# EAGLE design Daughter board (EAGLE 9.5.2)
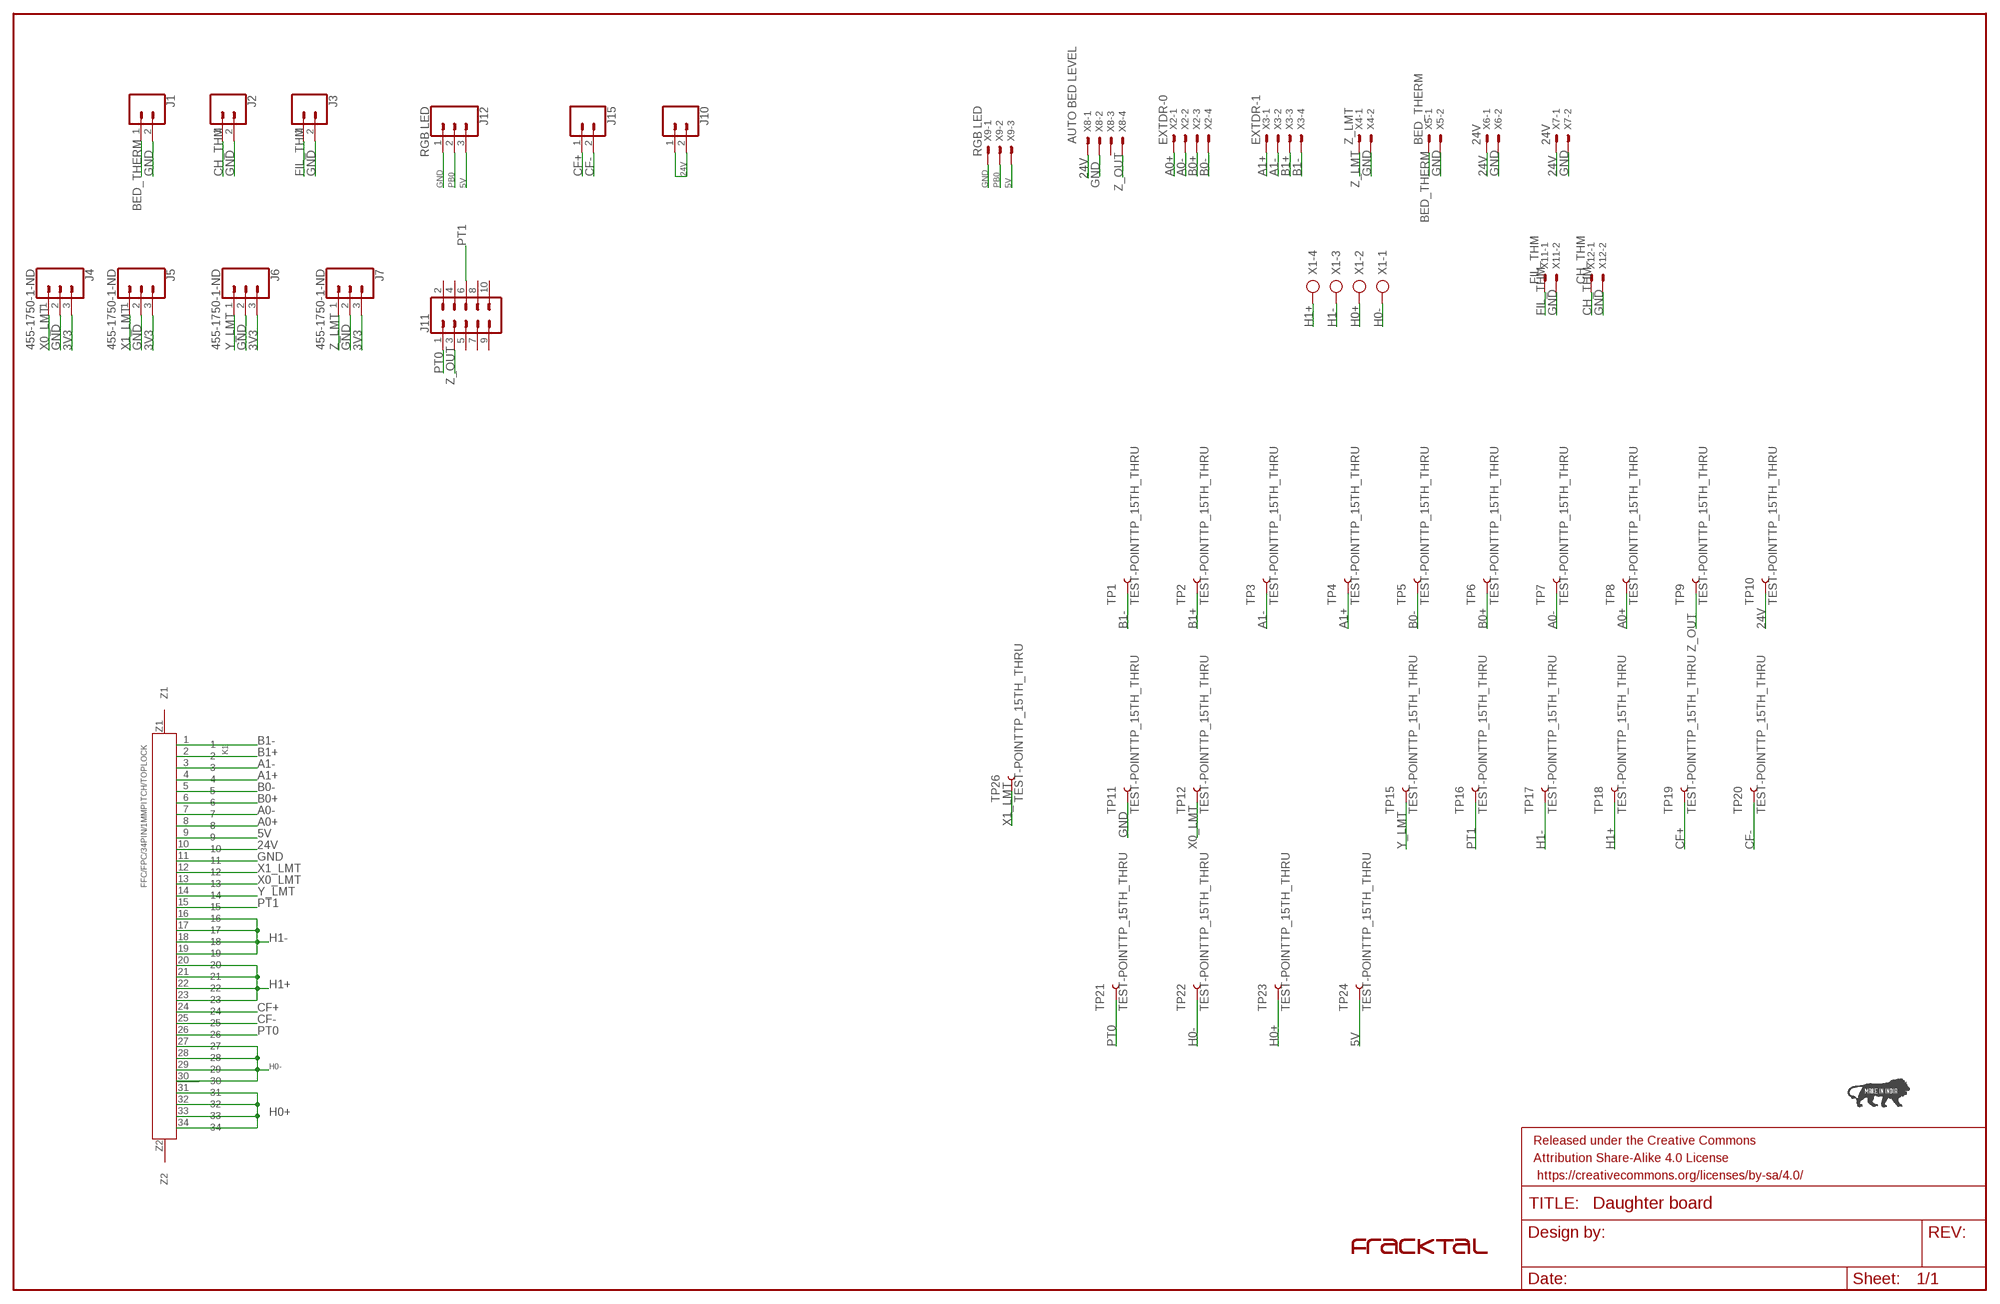
[diagram p0: schematic, sheet 1]

## Parts
FRAME1  FRAME-LEDGER  [CREATIVE_COMMONS]
J1  CONN_02  [1X02]
J2  CONN_02  [1X02]
J3  CONN_02  [1X02]
J4  455-1750-1-ND  CONN_03  [1X03]
J5  455-1750-1-ND  CONN_03  [1X03]
J6  455-1750-1-ND  CONN_03  [1X03]
J7  455-1750-1-ND  CONN_03  [1X03]
J10  CONN_02  [1X02]
J11  CONN_05X2NO_SILK  [2X5_NOSILK]
J12  RGB LED  CONN_03  [1X03]
J15  CONN_02  [1X02]
K1  FFC/FPC/34PIN/1MMPITCH/TOPLOCK  [34PIN/1MMPITCH/FFC/FPC]
TP1  TEST-POINTTP_15TH_THRU  [TP_15TH]
TP2  TEST-POINTTP_15TH_THRU  [TP_15TH]
TP3  TEST-POINTTP_15TH_THRU  [TP_15TH]
TP4  TEST-POINTTP_15TH_THRU  [TP_15TH]
TP5  TEST-POINTTP_15TH_THRU  [TP_15TH]
TP6  TEST-POINTTP_15TH_THRU  [TP_15TH]
TP7  TEST-POINTTP_15TH_THRU  [TP_15TH]
TP8  TEST-POINTTP_15TH_THRU  [TP_15TH]
TP9  TEST-POINTTP_15TH_THRU  [TP_15TH]
TP10  TEST-POINTTP_15TH_THRU  [TP_15TH]
TP11  TEST-POINTTP_15TH_THRU  [TP_15TH]
TP12  TEST-POINTTP_15TH_THRU  [TP_15TH]
TP15  TEST-POINTTP_15TH_THRU  [TP_15TH]
TP16  TEST-POINTTP_15TH_THRU  [TP_15TH]
TP17  TEST-POINTTP_15TH_THRU  [TP_15TH]
TP18  TEST-POINTTP_15TH_THRU  [TP_15TH]
TP19  TEST-POINTTP_15TH_THRU  [TP_15TH]
TP20  TEST-POINTTP_15TH_THRU  [TP_15TH]
TP21  TEST-POINTTP_15TH_THRU  [TP_15TH]
TP22  TEST-POINTTP_15TH_THRU  [TP_15TH]
TP23  TEST-POINTTP_15TH_THRU  [TP_15TH]
TP24  TEST-POINTTP_15TH_THRU  [TP_15TH]
TP26  TEST-POINTTP_15TH_THRU  [TP_15TH]
U$1  FRACKTALLOGO  [FRACKTALLOGO]
U$2  MAKEININDIA  [MAKEININDIA]
X1  AK500/4  [AK500/4]
X2  EXTDR-0  JST-XH-04-PIN-LONG-PAD  [JST-XH-04-PACKAGE-LONG-PAD]
X3  EXTDR-1  JST-XH-04-PIN-LONG-PAD  [JST-XH-04-PACKAGE-LONG-PAD]
X4  Z_LMT  JST-XH-02-PIN-LONG-PAD  [JST-XH-02-PACKAGE-LONG-PAD]
X5  BED_THERM  JST-XH-02-PIN-LONG-PAD  [JST-XH-02-PACKAGE-LONG-PAD]
X6  24V  JST-XH-02-PIN-LONG-PAD  [JST-XH-02-PACKAGE-LONG-PAD]
X7  24V  JST-XH-02-PIN-LONG-PAD  [JST-XH-02-PACKAGE-LONG-PAD]
X8  AUTO BED LEVELING  JST-XH-04-PIN-LONG-PAD  [JST-XH-04-PACKAGE-LONG-PAD]
X9  RGB LED  JST-XH-03-PIN-LONG-PAD  [JST-XH-03-PACKAGE-LONG-PAD]
X11  FIL_THM  JST-XH-02-PIN-LONG-PAD  [JST-XH-02-PACKAGE-LONG-PAD]
X12  CH_THM  JST-XH-02-PIN-LONG-PAD  [JST-XH-02-PACKAGE-LONG-PAD]

## Nets
3V3: J4.3 J5.3 J6.3 J7.3
5V: J12.3 K1.9 TP24.P$1 X9.3
24V: J10.1 J10.2 K1.10 TP10.P$1 X6.1 X7.1 X8.1
A0+: K1.8 TP8.P$1 X2.1
A0-: K1.7 TP7.P$1 X2.2
A1+: K1.4 TP4.P$1 X3.1
A1-: K1.3 TP3.P$1 X3.2
B0+: K1.6 TP6.P$1 X2.3
B0-: K1.5 TP5.P$1 X2.4
B1+: K1.2 TP2.P$1 X3.3
B1-: K1.1 TP1.P$1 X3.4
BED_THERM: J1.1 X5.1
CF+: J15.1 K1.24 TP19.P$1
CF-: J15.2 K1.25 TP20.P$1
CH_THM: J2.1 X12.1
FIL_THM: J3.1 X11.1
GND: J1.2 J2.2 J3.2 J4.2 J5.2 J6.2 J7.2 J12.1 K1.11 TP11.P$1 X4.2 X5.2 X6.2 X7.2 X8.2 X9.1 X11.2 X12.2
H0+: K1.31 K1.32 K1.33 K1.34 TP23.P$1 X1.2
H0-: K1.27 K1.28 K1.29 K1.30 TP22.P$1 X1.1
H1+: K1.20 K1.21 K1.22 K1.23 TP18.P$1 X1.4
H1-: K1.16 K1.17 K1.18 K1.19 TP17.P$1 X1.3
PB0: J12.2 X9.2
PT0: J11.1 K1.26 TP21.P$1
PT1: J11.6 K1.15 TP16.P$1
X0_LMT: J4.1 K1.13 TP12.P$1
X1_LMT: J5.1 K1.12 TP26.P$1
Y_LMT: J6.1 K1.14 TP15.P$1
Z_LMT: J7.1 X4.1
Z_OUT: J11.3 TP9.P$1 X8.4
Unconnected: J11.2 J11.4 J11.5 J11.7 J11.8 J11.9 J11.10 K1.Z1 K1.Z2 X8.3

## Library data of the parts
FRAME1 = SparkFun-Aesthetics:FRAME-LEDGER: Schematic Frame - Ledger Standard 11x14 US Ledger frame
J1-J3 J10 J15 = SparkFun-Connectors:CONN_02: Multi connection point. Often used as Generic Header-pin footprint for 0.1 inch spaced/style header connections On any of the 0.1 inch spaced packages, you can populate with these: Break Away Headers - Straight <https://www.sparkfun.com/products/116> (PRT-00116) Break Away Male Headers - Right Angle <https://www.sparkfun.com/products/553> (PRT-00553) Female Headers <https://www.sparkfun.com/products/115> (PRT-00115) Break Away Headers - Machine Pin <https://www.sparkfun.com/products/117> (PRT-00117) Break Away Female Headers - Swiss Machine Pin <https://www.sparkfun.com/products/743> (PRT-00743) For SCREWTERMINALS and SPRING TERMINALS visit here: Screw Terimnals on SparkFun.com <https://www.sparkfun.com/search/results?term=Screw+Terminals> (5mm/3.5mm/2.54mm spacing) This device is also useful as a general connection point to wire up your design to another part of your project. Our various solder wires solder well into these plated through hole pads. Hook-Up Wire - Assortment (Stranded, 22 AWG) <https://www.sparkfun.com/products/11375> (PRT-11375) Hook-Up Wire - Assortment (Solid Core, 22 AWG) <https://www.sparkfun.com/products/11367> (PRT-11367) View the entire wire category on our website here <https://www.sparkfun.com/categories/141> Special notes: Molex polarized connector foot print use with: PRT-08233 with associated crimp pins and housings. 2.54_SCREWTERM for use with PRT-10571. 3.5mm Screw Terminal footprints for PRT-08084 5mm Screw Terminal footprints for use with PRT-08432
J4-J7 = SparkFun-Connectors:CONN_03: Multi connection point. Often used as Generic Header-pin footprint for 0.1 inch spaced/style header connections On any of the 0.1 inch spaced packages, you can populate with these: Break Away Headers - Straight <https://www.sparkfun.com/products/116> (PRT-00116) Break Away Male Headers - Right Angle <https://www.sparkfun.com/products/553> (PRT-00553) Female Headers <https://www.sparkfun.com/products/115> (PRT-00115) Break Away Headers - Machine Pin <https://www.sparkfun.com/products/117> (PRT-00117) Break Away Female Headers - Swiss Machine Pin <https://www.sparkfun.com/products/743> (PRT-00743) Stackable Header - 3 Pin (Female, 0.1") <https://www.sparkfun.com/products/13875> (PRT-13875) For SCREWTERMINALS and SPRING TERMINALS visit here: Screw Terimnals on SparkFun.com <https://www.sparkfun.com/search/results?term=Screw+Terminals> (5mm/3.5mm/2.54mm spacing) This device is also useful as a general connection point to wire up your design to another part of your project. Our various solder wires solder well into these plated through hole pads. Hook-Up Wire - Assortment (Stranded, 22 AWG) <https://www.sparkfun.com/products/11375> (PRT-11375) Hook-Up Wire - Assortment (Solid Core, 22 AWG) <https://www.sparkfun.com/products/11367> (PRT-11367) View the entire wire category on our website here <https://www.sparkfun.com/categories/141> Special notes: Molex polarized connector foot print use with SKU : PRT-08232 with associated crimp pins and housings.; PROD_ID: XXX-00000
J11 = SparkFun-Connectors:CONN_05X2: Multi connection point. Often used as Generic Header-pin footprint for 0.1 inch spaced/style header connections For AVR SPI programming port, see special device with nice symbol: "AVR_SPI_PROG_5x2.dev" You can populate with any combo of single row headers, but if you'd like an exact match, check these: 2x5 AVR ICSP Male Header <https://www.sparkfun.com/products/778> (PRT-00778) 2x5 Pin Shrouded Header <https://www.sparkfun.com/products/8506> (PRT-08506) On any of the 0.1 inch spaced packages, you can populate with these: Break Away Headers - Straight <https://www.sparkfun.com/products/116> (PRT-00116) Break Away Male Headers - Right Angle <https://www.sparkfun.com/products/553> (PRT-00553) Female Headers <https://www.sparkfun.com/products/115> (PRT-00115) Break Away Headers - Machine Pin <https://www.sparkfun.com/products/117> (PRT-00117) Break Away Female Headers - Swiss Machine Pin <https://www.sparkfun.com/products/743> (PRT-00743) Special note: the shrouded connector mates well with our 5x2 ribbon cables: 2x5 Pin IDC Ribbon Cable <https://www.sparkfun.com/products/8535> (PRT-08535)
J12 = SparkFun-Connectors:CONN_03: Multi connection point. Often used as Generic Header-pin footprint for 0.1 inch spaced/style header connections On any of the 0.1 inch spaced packages, you can populate with these: Break Away Headers - Straight <https://www.sparkfun.com/products/116> (PRT-00116) Break Away Male Headers - Right Angle <https://www.sparkfun.com/products/553> (PRT-00553) Female Headers <https://www.sparkfun.com/products/115> (PRT-00115) Break Away Headers - Machine Pin <https://www.sparkfun.com/products/117> (PRT-00117) Break Away Female Headers - Swiss Machine Pin <https://www.sparkfun.com/products/743> (PRT-00743) Stackable Header - 3 Pin (Female, 0.1") <https://www.sparkfun.com/products/13875> (PRT-13875) For SCREWTERMINALS and SPRING TERMINALS visit here: Screw Terimnals on SparkFun.com <https://www.sparkfun.com/search/results?term=Screw+Terminals> (5mm/3.5mm/2.54mm spacing) This device is also useful as a general connection point to wire up your design to another part of your project. Our various solder wires solder well into these plated through hole pads. Hook-Up Wire - Assortment (Stranded, 22 AWG) <https://www.sparkfun.com/products/11375> (PRT-11375) Hook-Up Wire - Assortment (Solid Core, 22 AWG) <https://www.sparkfun.com/products/11367> (PRT-11367) View the entire wire category on our website here <https://www.sparkfun.com/categories/141> Special notes: Molex polarized connector foot print use with SKU : PRT-08232 with associated crimp pins and housings.; PROD_ID: XXX-00000; VALUE: 455-1750-1-ND
K1 = FracktalWorks_Eagle_Library:FFC/FPC/34PIN/1MMPITCH/TOPLOCK
TP1-TP12 TP15-TP24 TP26 = SparkFun-Connectors:TEST-POINT: SparkFun Test Points Bare copper test points for troubleshooting or In-Circuit-Testing. These are used by our Production team for verifying production board runs using pogo-pins on test beds. SparkFun Products: SparkFun LSM9DS1 Breakout <https://www.sparkfun.com/products/13284> SparkFun PSOC <https://www.sparkfun.com/products/13714> SparkFun Load Cell Amplifier <https://www.sparkfun.com/products/13879>
U$1 = FracktalWorks_Eagle_Library:FRACKTALLOGO
U$2 = FracktalWorks_Eagle_Library:MAKEININDIA
X1 = con-ptr500:AK500/4: CONNECTOR; OC_FARNELL: unknown; OC_NEWARK: unknown
X2 X3 = Rembrandt Electronics - JST XH Connectors v1-0:JST-XH-04-PIN: JST XH Connector 2 Pin Wire to board connector. Pitch: 2,54 mm, (0.100") Number of pins: 4 Created by Rembrandt Electronics www.rembrandtelectronics.com
X4-X7 X11 X12 = Rembrandt Electronics - JST XH Connectors v1-0:JST-XH-02-PIN: JST XH Connector 2 Pin Wire to board connector. Pitch: 2,54 mm, (0.100") Number of pins: 2 Created by Rembrandt Electronics www.rembrandtelectronics.com
X8 = Rembrandt Electronics - JST XH Connectors v1-0:JST-XH-04-PIN: JST XH Connector 2 Pin Wire to board connector. Pitch: 2,54 mm, (0.100") Number of pins: 4 Created by Rembrandt Electronics www.rembrandtelectronics.com; AUTOBEDLEVL: AUTO BED LEVEL
X9 = Rembrandt Electronics - JST XH Connectors v1-0:JST-XH-03-PIN: JST XH Connector 2 Pin Wire to board connector. Pitch: 2,54 mm, (0.100") Number of pins: 3 Created by Rembrandt Electronics www.rembrandtelectronics.com

## Net classes
0 default: width 0.406 mm, drill 0.254 mm, clearance 0.203 mm

## Board
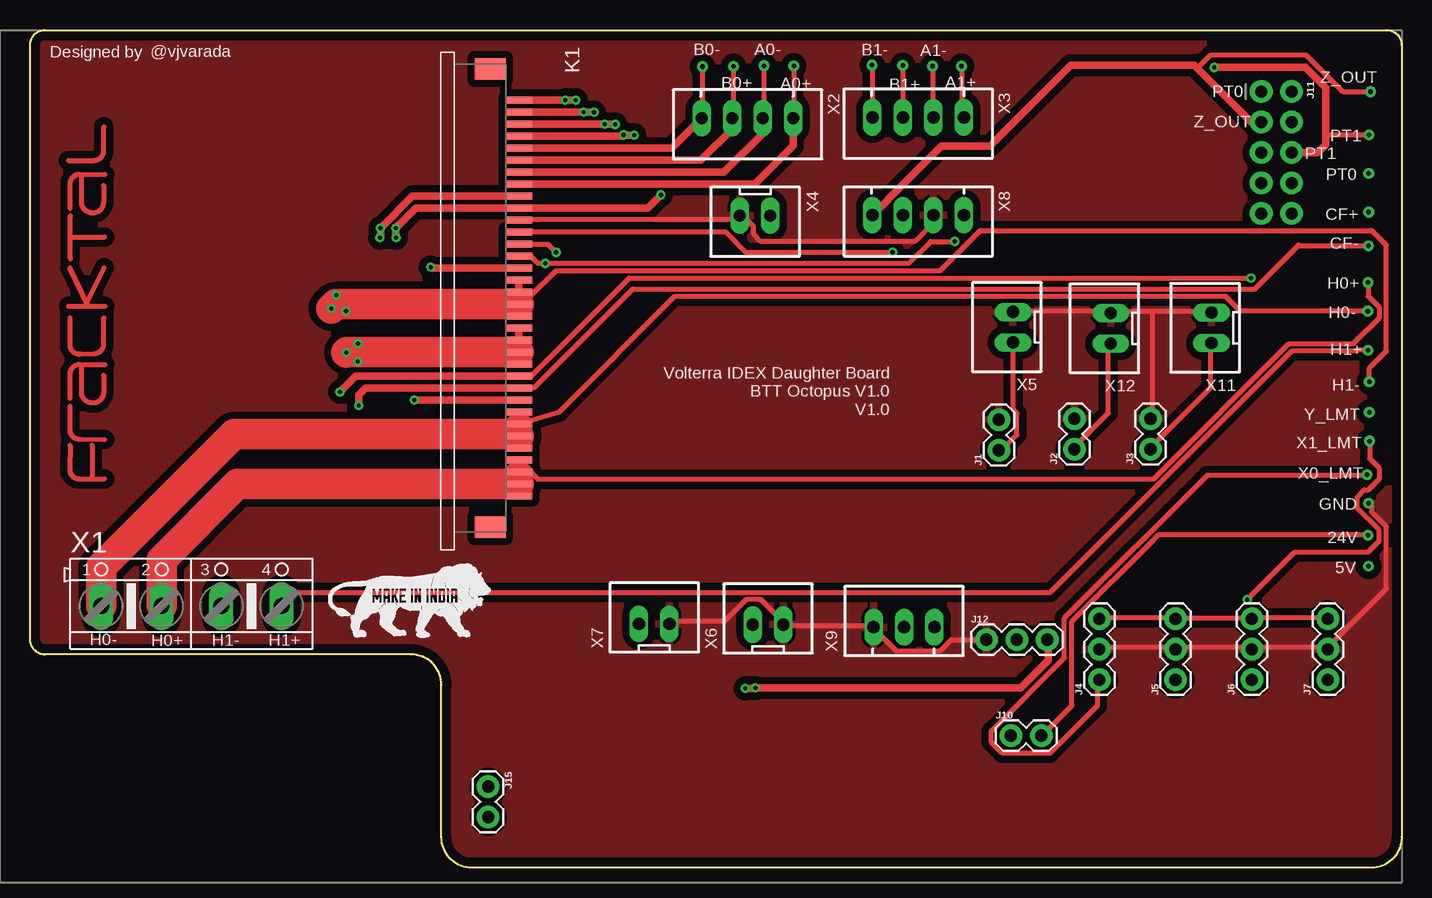
[diagram p1: board, top side]
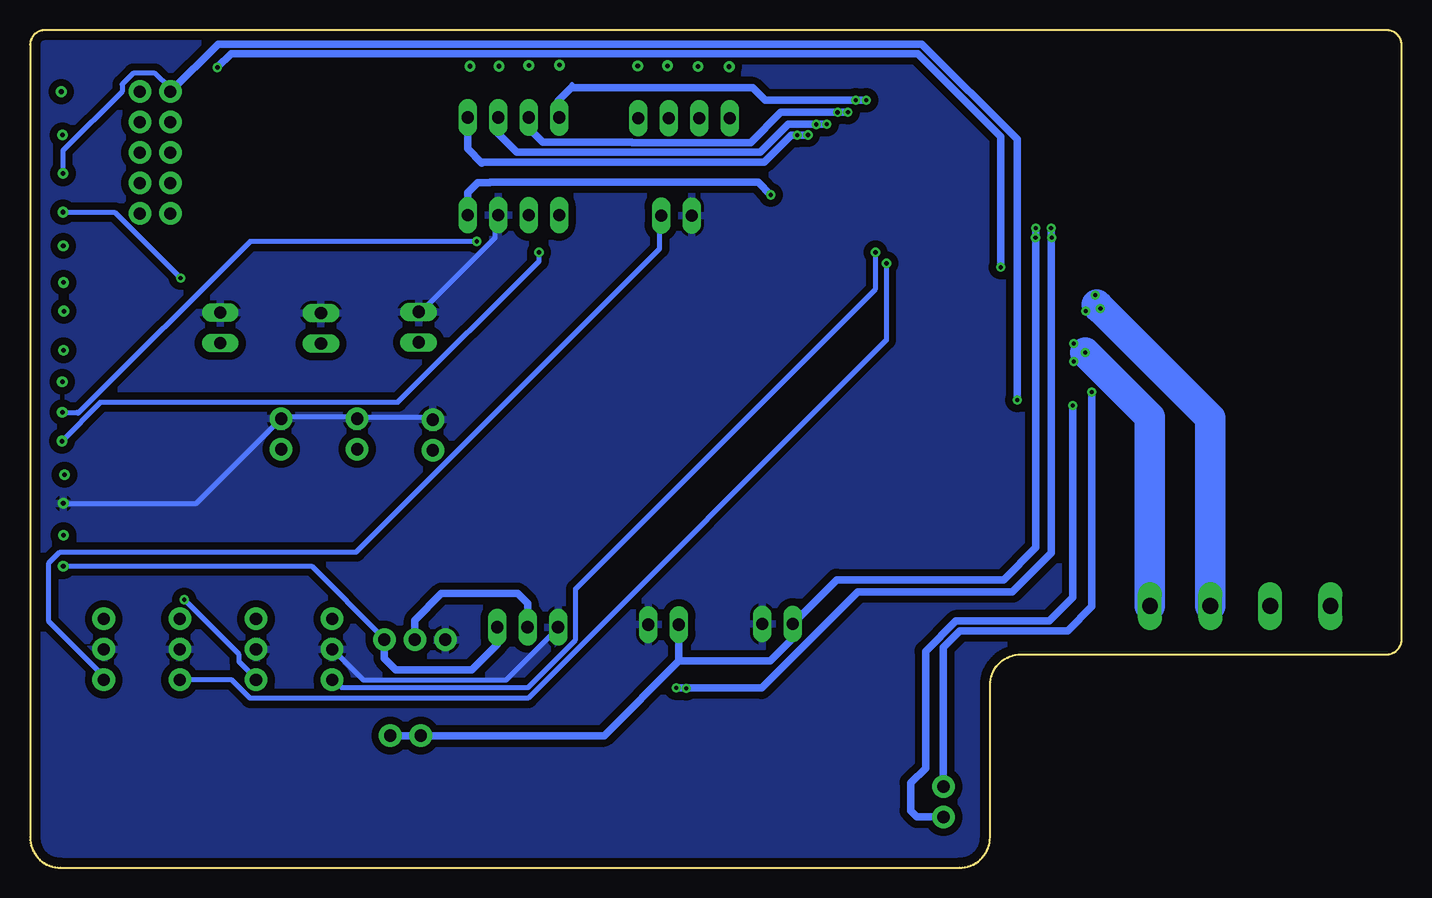
[diagram p2: board, bottom side, seen from below]

Size 114.3 x 69.85 mm. Coordinates in mm from the lower left corner, seen from the top.
Outline: 1.27,69.85 113.03,69.85 arc-90 114.3,68.58 114.3,2.54 arc-90 111.76,0 36.83,0 arc-90 34.29,2.54 34.29,15.24 arc90 31.75,17.78 1.27,17.78 arc-90 0,19.05 0,68.58 arc-90 1.27,69.85
Copper layers (1*16): Top 0.035mm / dielectric 1.5mm / Bottom 0.035mm
Design rules "LionCircuits": minimum track width 8mil, minimum drill 0.35mm, track to track 8mil, track to pad 8mil, pad to pad 8mil, via to via 8mil, smd to smd 8mil, copper to edge 30mil, drill to drill 10mil, minimum pad ring 10mil, minimum via ring 8mil, stop-mask expansion 4mil, vias tented up to drill 0mil, thermal gap 10mil

### Footprints (pad centres in the part's own frame; a part is rotated, then mirrored left to right if it is on the bottom)
1X02 = drill 1.016 pad 1.88: 1 0,0; 2 2.54,0
1X03 = drill 1.016 pad 1.88: 1 0,0; 2 2.54,0; 3 5.08,0
2X5_NOSILK = drill 1.016 pad 1.88: 1 0,0; 2 0,2.54; 3 2.54,0; 4 2.54,2.54; 5 5.08,0; 6 5.08,2.54; 7 7.62,0; 8 7.62,2.54; 9 10.16,0; 10 10.16,2.54
34PIN/1MMPITCH/FFC/FPC = smd 0.6 x 2.2: 1 -14.43,2.1; 2 -13.43,2.1; 3 -12.43,2.1; 4 -11.43,2.1; 5 -10.43,2.1; 6 -9.43,2.1; 7 -8.43,2.1; 8 -7.43,2.1; 9 -6.43,2.1; 10 -5.43,2.1; 11 -4.43,2.1; 12 -3.43,2.1; 13 -2.43,2.1; 14 -1.43,2.1; 15 -0.43,2.1; 16 0.57,2.1; 17 1.57,2.1; 18 2.57,2.1; 19 3.57,2.1; 20 4.57,2.1; 21 5.57,2.1; 22 6.57,2.1; 23 7.57,2.1; 24 8.57,2.1; 25 9.57,2.1; 26 10.57,2.1; 27 11.57,2.1; 28 12.57,2.1; 29 13.57,2.1; 30 14.57,2.1; 31 15.57,2.1; 32 16.57,2.1; 33 17.57,2.1; 34 18.57,2.1 | smd 1.8 x 2.6: Z1 -17.03,-0.3; Z2 21.17,-0.3
TP_15TH = drill 0.381 pad 0.61: P$1 0,0
AK500/4 = drill 1.321 long: 1 -7.518,0; 2 -2.489,0; 3 2.489,0; 4 7.518,0
JST-XH-04-PACKAGE-LONG-PAD = drill 1.016 long: 1 -3.81,0; 2 -1.27,0; 3 1.27,0; 4 3.81,0
JST-XH-02-PACKAGE-LONG-PAD = drill 1.016 long: 1 -1.27,0; 2 1.27,0
JST-XH-03-PACKAGE-LONG-PAD = drill 1.016 long: 1 -2.54,0; 2 0,0; 3 2.54,0

### Placement (x,y rotation side)
FRAME1  -116.84,-10.16 0 top  (outside the outline)
J1  80.73,34.81 90 top
J2  87.03,34.9 90 top
J3  93.37,34.9 90 top
J4  89.12,15.67 90 top
J5  95.47,15.67 90 top
J6  101.82,15.67 90 top
J7  108.15,15.67 90 top
J10  81.74,11.01 0 top
J11  102.6,64.71 270 top
J12  79.69,19.01 0 top
J15  38.18,6.77 270 top
K1  38.65,49.56 270 top
TP1  70.18,66.92 0 bottom
TP2  72.73,66.9 0 bottom
TP3  75.22,66.83 0 bottom
TP4  77.64,66.83 0 bottom
TP5  56.03,66.79 0 bottom
TP6  58.62,66.81 0 bottom
TP7  61.16,66.87 0 bottom
TP8  63.65,66.84 0 bottom
TP9  111.7,64.71 90 bottom
TP10  111.51,27.74 90 bottom
TP11  111.53,30.38 90 bottom
TP12  111.43,32.77 90 bottom
TP15  111.61,37.97 90 bottom
TP16  111.58,61.09 90 bottom
TP17  111.61,40.53 90 bottom
TP18  111.51,43.14 90 bottom
TP19  111.56,54.66 270 bottom
TP20  111.53,51.84 270 bottom
TP21  111.56,57.9 90 bottom
TP22  111.48,46.41 90 bottom
TP23  111.51,48.79 90 bottom
TP24  111.53,25.15 0 bottom
TP26  111.63,35.57 90 bottom
U$1  6.31,44.41 90 top
U$2  25.82,18.48 0 top
X1  13.45,21.82 0 top
X2  59.79,62.5 180 top
X3  74.02,62.56 180 top
X4  60.43,54.37 180 top
X5  81.92,45.07 90 top
X6  61.51,20.27 0 top
X7  52.02,20.33 0 top
X8  74.02,54.41 180 top
X9  72.83,20.05 0 top
X11  98.45,45.01 90 top
X12  90.06,44.97 90 top

### Tracks (layer width: path | path; a pad name or v marks a point on that pad's centre or on a via)
3V3
  Top 0.406: J7.3 108.15,20.83 102.06,20.83 J6.3 101.75,20.83 95.66,20.83 J5.3 95.35,20.83 89.26,20.83 J4.3
5V  (via drill 0.35)
  Top 0.61: K1.9 31.86,55.98 v29.21,53.34 29.21,52.58 v29.16,52.53 | J12.3 84.84,18.95 84.84,17.27 82.55,14.99 v60.45,14.99 60.43,14.96 v59.61,14.96
  Bottom 0.406: J12.3 84.99,19.3 90.83,25.15 TP24.P$1
  Bottom 0.61: J12.3 84.77,17.46 83.82,16.51 77.47,16.51 75.38,18.6 X9.3 | v29.21,53.34 29.21,26.23 32.43,23.01 45.31,23.01 53.34,14.99 v60.45,14.99
24V  (via drill 0.35)
  Top 0.406: J10.2 84.38,11.07 86.82,13.51 86.82,20.52 93.6,27.3 93.83,27.53 94.03,27.74 TP10.P$1
  Top 0.61: v52.58,56.1 51.46,54.98 K1.10 32.12,54.98 v30.48,53.34 30.48,52.55 v30.5,52.53
  Bottom 0.61: J10.2 J10.1 66.46,11.01 60.24,17.23 | X6.1 60.24,17.23 | 60.24,17.23 52.62,17.23 50.75,19.1 X7.1 47.08,24 33.17,24 30.48,26.69 v30.48,53.34 | v52.58,56.1 53.63,57.15 75.96,57.15 75.97,57.14 76.97,57.14 77.83,56.29 X8.1
A0+
  Top 0.406: 63.65,62.59 X2.1 63.65,62.55 | TP8.P$1 63.65,62.15 63.6,62.1
  Top 0.61: K1.8 60.38,56.98 63.6,60.21 63.6,62.1 X2.1
A0-
  Top 0.406: 61.21,62.59 X2.2 61.16,62.6 TP7.P$1
  Top 0.61: K1.7 57.83,57.98 61.06,61.21 X2.2
A1+  (via drill 0.35)
  Top 0.406: 77.67,62.59 X3.1 77.64,62.75 TP4.P$1
  Top 0.61: K1.4 49.35,60.98 v49.47,61.1 50.33,61.1 v50.36,61.07
  Bottom 0.61: v49.47,61.1 50.86,61.1 53.12,58.84 76.57,58.84 76.65,58.76 77.83,59.94 X3.1
A1-  (via drill 0.35)
  Top 0.406: X3.2 75.24,62.59 75.22,62.6 TP3.P$1
  Top 0.61: K1.3 47.88,61.98 | 47.88,61.98 v47.89,62 | v48.77,61.98 47.89,61.98 47.88,61.98
  Bottom 0.61: v47.89,62 51.11,62 53.45,59.65 73.72,59.65 75.29,61.21 X3.2
B0+
  Top 0.406: 58.78,62.59 X2.3 | TP6.P$1 58.62,62.47 58.59,62.43
  Top 0.61: K1.6 55.9,58.98 58.59,61.67 58.59,62.43 X2.3
B0-
  Top 0.406: 56.03,62.59 X2.4 56.03,62.55 TP5.P$1
  Top 0.61: K1.5 53.47,59.98 X2.4
B1+  (via drill 0.35)
  Top 0.406: X3.3 72.8,62.59 72.73,62.65 TP2.P$1
  Top 0.61: K1.2 v46.13,62.98 v46.14,62.99 46.99,62.99 v47,62.98
  Bottom 0.61: v46.14,62.99 51.73,62.99 54.25,60.47 64.13,60.47 64.14,60.48 71.55,60.48 73.06,61.99 73.06,62.24 X3.3
B1-  (via drill 0.35)
  Top 0.406: TP1.P$1 70.18,62.59 X3.4
  Top 0.61: K1.1 44.61,63.98 v44.62,64 v44.63,64.01 v45.49,64.01
  Bottom 0.406: 69.14,65.33 69.14,65.04
  Bottom 0.61: v44.62,64 53.03,64 54.08,65.04 69.14,65.04 69.2,65.04 70.27,63.97 70.27,62.62 X3.4
BED_THERM
  Top 0.406: X5.1 81.94,43.69 81.94,38.2 82.25,37.9 82.25,36.07 81.03,34.85 J1.1
CF+  (via drill 0.35)
  Top 0.406: v101.75,49.17 49.94,49.17 41.73,40.97 40.76,40.97 K1.24
  Top 0.61: K1.24 27.14,40.98 v25.83,39.67
  Bottom 0.406: v101.75,49.17 107.24,54.66 TP19.P$1
  Bottom 0.61: v25.83,39.67 25.83,21.77 27.84,19.76 36.81,19.76 38.2,18.36 38.2,6.79 J15.1
CF-  (via drill 0.35)
  Top 0.406: 105.64,51.84 105.72,51.92 | K1.25 40.79,40.03 42.01,40.03 50.24,48.26 102.06,48.26 105.42,51.62 105.64,51.84 | TP20.P$1 105.64,51.84
  Top 0.61: K1.25 28,39.98 27.41,39.39 v27.41,38.53
  Bottom 0.61: v27.41,38.53 27.41,22.53 29.36,20.57 37.14,20.57 39.68,18.04 39.68,8.31 40.89,7.09 40.92,7.09 40.92,4.75 40.4,4.23 J15.2
CH_THM
  Top 0.406: X12.1 89.87,43.69 89.87,37.9 87.12,35.15 J2.1
FIL_THM
  Top 0.406: X11.1 98.4,43.69 98.4,40.03 93.52,35.15 J3.1
GND
  Top 0.406: X7.2 53.29,20.52 57.86,20.52 59.69,22.35 60.91,22.35 62.74,20.52 X6.2 63.04,20.22 70.05,20.22 X9.1 70.36,19.91 72.19,18.08 75.84,18.08 76.76,19 79.5,19 J12.1 | J4.2 89.26,18.39 95.35,18.39 J5.2 95.66,18.39 101.75,18.39 J6.2 102.06,18.39 108.15,18.39 | 108.15,18.39 113.03,23.27 113.03,28.45 111.81,29.67 111.81,30.1 TP11.P$1 | 108.15,18.39 J7.2 | K1.11 40.79,54.05 58.78,54.05 59.08,54.36 X4.2 59.39,54.36 60.3,53.44 60.3,52.83 60.91,52.22 73.71,52.22 75.29,53.8 X8.2 | X5.2 81.94,46.43 89.87,46.43 X12.2 90.17,46.43 93.52,46.43 | 93.52,46.43 98.4,46.43 X11.2 | 93.52,46.43 93.52,37.59 J3.2
  Bottom 0.406: X9.1 70.36,19.91 74.62,15.65 86.51,15.65 88.95,18.08 J4.2 | J1.2 81.03,37.59 86.82,37.59 J2.2 87.12,37.59 93.22,37.59 J3.2 100.43,30.38 TP11.P$1 | X8.2 75.54,54.36 75.54,52.53 81.64,46.43 X5.2
  pour Top (isolate 0.61): 1.6,69.52 112.65,69.52 113.89,68.28 113.89,1.68 112.78,0.56 35.08,0.56 34.34,1.3 34.34,14.76 31.27,17.83 0.61,17.83 -0.74,19.18 -0.74,67.18
  pour Bottom (isolate 0.61): -0.1,68.28 1.32,69.7 3.2,69.7 112.42,69.7 114.25,67.87 114.25,2.72 111.76,0.23 36.27,0.23 34.24,2.26 34.24,15.19 34.39,15.34 31.98,17.75 2.13,17.75 0.05,19.84 0.05,20.83 0.05,68.1 -0.1,68.25
H0+
  Top 0.406: K1.31 42.35,32.38 93.6,32.38 104.9,43.69 110.29,43.69 112.42,45.82 112.42,46.74 111.51,47.65 TP23.P$1 | K1.34 40.79,31.19 K1.33 40.79,33.02 K1.32
  Top 0.61: K1.31 K1.32 K1.33 | K1.31 41.66,33.07 41.66,32.96 | K1.31 39.83,33.07 39.79,33.07
  Top 2.54: X1.2 10.96,25.65 17.29,31.98 K1.33
H0-
  Top 0.406: K1.30 40.79,35.15 40.59,36.14 | 41.5,37.22 44.06,37.96 53.75,47.65 99.62,47.65 100.86,46.41 TP22.P$1 | 39.88,36.14 39.88,36.98 K1.28
  Top 0.61: K1.27 K1.28 | K1.27 41.5,37.23 41.5,37.22 41.5,37.02 40.75,37.78 K1.27 | K1.27 39.93,37.17 39.93,37.15
  Top 2.54: X1.1 5.93,25.07 17,36.14 39.88,36.14 40.59,36.14 K1.29
H1+  (via drill 0.35)
  Top 0.406: X1.4 20.98,22.05 21.9,22.96 85.04,22.96 105.16,43.08 110.54,43.08 110.6,43.14 TP18.P$1 | K1.23 40.79,42.16 K1.22 40.79,43.99 K1.21
  Top 0.61: K1.20 K1.21
  Top 2.54: v26.37,42.96 26.39,42.98 K1.22
  Bottom 0.61: v27.33,43.7 27.1,43.7 v26.37,42.96 27.12,42.22 v27.32,42.22
  Bottom 2.54: X1.4 20.97,37.57 v26.37,42.96
H1-  (via drill 0.35)
  Top 0.406: K1.18 41.71,47.65 43.84,49.78 75.84,49.78 79.2,53.14 111.81,53.14 113.03,51.92 113.03,43.08 111.61,41.66 TP17.P$1 | K1.19 40.79,46.13 K1.18 | K1.17 40.79,47.95 K1.18
  Top 0.61: K1.16 K1.17
  Top 2.54: K1.18 25.46,46.98 v25.09,46.62
  Bottom 0.61: v25.53,47.75 25.53,47.09 25.4,46.97 25.96,46.41 v26.33,46.41
  Bottom 2.54: X1.3 15.94,37.5 25.4,46.97 25.42,46.95 v25.09,46.62
PB0
  Bottom 0.61: J12.2 82.23,20.64 80.01,22.86 73.66,22.86 72.84,22.03 X9.2
PT0  (via drill 0.35)
  Top 0.61: K1.26 v32.03,38.98 v32.03,38.99
  Bottom 0.406: J11.1 102.67,65.02 103.89,66.24 105.72,66.24 106.63,65.33 106.63,64.72 111.56,59.79 TP21.P$1
  Bottom 0.61: v32.03,38.99 32.03,60.73 39.98,68.68 98.63,68.68 J11.1
PT1  (via drill 0.35)
  Top 0.406: TP16.P$1 108.1,61.09 107.97,60.96
  Top 0.61: K1.15 33.48,49.98 v33.4,50.06 | v98.68,66.73 106.27,66.73 107.97,65.02 107.97,60.96 107.97,60.27 107.33,59.63 J11.6
  Bottom 0.61: v33.4,50.06 33.4,60.95 40.32,67.87 97.54,67.87 v98.68,66.73
X0_LMT  (via drill 0.35)
  Top 0.406: J4.1 88.95,15.65 88.95,13.51 84.99,9.55 81.03,9.55 80.11,10.46 80.11,11.38 86.21,17.47 86.21,20.83 98.09,32.71 111.38,32.71 TP12.P$1 | K1.13 40.76,51.97 43.18,51.97 v43.84,51.31
  Bottom 0.406: v43.84,51.31 43.84,48.26 68.83,23.27 68.83,19 72.8,15.04 88.34,15.04 88.95,15.65 J4.1
X1_LMT  (via drill 0.35)
  Top 0.406: v101.45,22.35 105.41,26.31 111.51,26.31 112.42,27.23 112.42,28.14 110.59,29.97 110.59,30.89 111.2,31.5 111.51,31.5 112.42,32.41 112.42,33.32 111.63,34.11 TP26.P$1 | K1.12 58.01,52.98 59.69,51.31 v71.88,51.31
  Bottom 0.406: v101.45,22.35 96.88,17.78 96.88,17.17 95.66,15.95 J5.1 | v71.88,51.31 71.88,50.57 83.64,38.81 108.4,38.81 | 108.46,38.81 108.4,38.81 | TP26.P$1 108.4,38.81
Y_LMT  (via drill 0.35)
  Top 0.406: v77.06,52.22 75.06,52.22 73.23,50.39 v42.93,50.39 42.32,50.39 41.73,50.98 40.75,50.98 K1.14
  Bottom 0.406: v77.06,52.22 95.96,52.22 110.29,37.9 110.36,37.97 TP15.P$1 | v42.93,50.39 42.93,43.99 72.8,14.12 95.96,14.12 97.48,15.65 101.75,15.65 J6.1
Z_LMT
  Bottom 0.406: X4.1 61.82,54.36 61.82,51.61 87.12,26.31 111.81,26.31 112.72,25.4 112.72,20.52 108.15,15.95 J7.1
Z_OUT
  Top 0.406: 97.28,66.65 98.4,67.77 106.32,67.77 109.39,64.71 TP9.P$1
  Top 0.61: X8.4 71.48,55.68 71.48,55.69 75.95,60.17 79.99,60.17 86.74,66.93 97,66.93 97.28,66.65 101.77,62.17 J11.3

### Text on the board
tNames: B0- | A0- | B1- | A1- | Designed by | @vjvarada | Z_OUT | B0+ | A0+ | B1+ | A1+ | PT0 | Z_OUT | PT1 | PT1 | PT0 | CF+ | CF- | H0+ | H0- | H1+ | Volterra IDEX Daughter Board / BTT Octopus V1.0 / V1.0 | H1- | Y_LMT | X1_LMT | X0_LMT | GND | 24V | 5V | H0- | H0+ | H1- | H1+